# Altium project M.2 TYPE A (NGFF) CONNECTOR TEMPLATE.PrjPcb
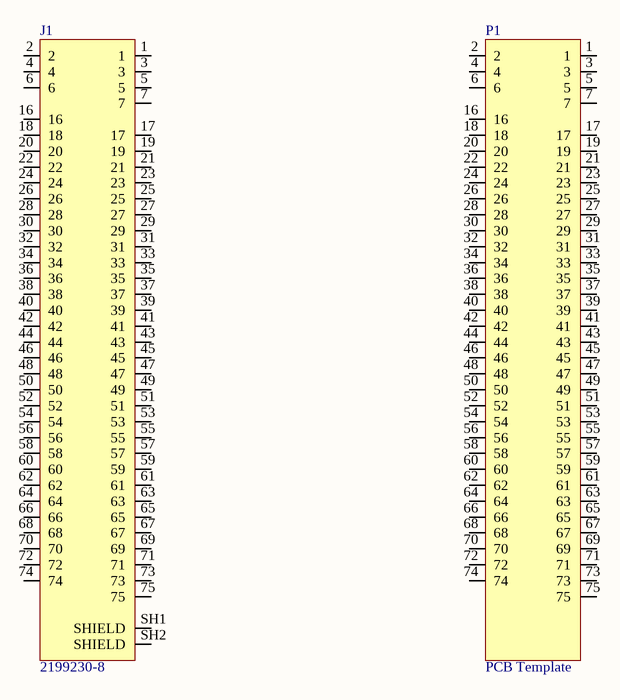
[diagram p0: M.2 TYPE A.SchDoc]
1 sheet, 2 parts. Net scope: global (net labels, ports and power ports of the same name join across sheets).
Board file: M.2 TYPE A.PcbDoc

## Sheet M.2 TYPE A.SchDoc
size A4

### Parts
J1  2199230-8  [CON-2199230-8]
P1  PCB Template  [M.2_A_2240_CARD]

### Nets

Not connected (* = marked no-connect by the designer): J1 1 2 3 4 5 6 7 16 17 18 19 20 21 22 23 24 25 26 27 28 29 30 31 32 33 34 35 36 37 38 39 40 41 42 43 44 45 46 47 48 49 50 51 52 53 54 55 56 57 58 59 60 61 62 63 64 65 66 67 68 69 70 71 72 73 74 75 SH1(SHIELD) SH2(SHIELD); P1 1 2 3 4 5 6 7 16 17 18 19 20 21 22 23 24 25 26 27 28 29 30 31 32 33 34 35 36 37 38 39 40 41 42 43 44 45 46 47 48 49 50 51 52 53 54 55 56 57 58 59 60 61 62 63 64 65 66 67 68 69 70 71 72 73 74 75

### Library data of the parts
J1 = CON-2199230-8: 67 Position Female Connector M.2 (NGFF) Mini Card Gold 0.020" (0.50mm) Black
P1 = CON-2199230-8